# Altium schematic sheet RelayBoard.SchDoc
size A4
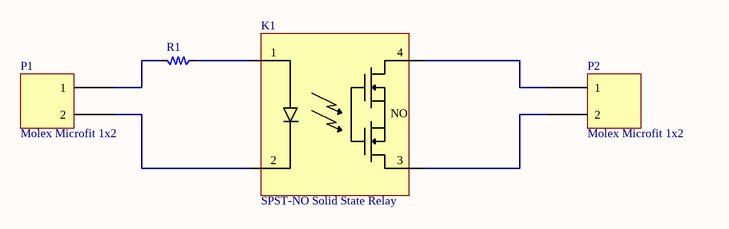
[diagram p0: RelayBoard.SchDoc]

## Parts
K1  SPST-NO Solid State Relay  [SPST-NO Solid State Relay - IXYS]
P1  Molex Microfit 1x2  [PCB_MLX_MICROFIT_1X2]
P2  Molex Microfit 1x2  [PCB_MLX_MICROFIT_1X2]
R1  SCH_GENERIC_RESISTOR_0603  [PCB_GENERIC_SMD_0603]  (value not drawn)

## Nets
NetK1_1: K1.1(Control_+) R1.1
NetK1_2: K1.2(Control_-) P1.2
NetK1_3: K1.3(Load) P2.2
NetK1_4: K1.4(Load) P2.1
NetP1_1: P1.1 R1.2

## Notes on the sheet
- (in symbol SPST-NO Solid State Relay) NO

## Library data of the parts
P1 P2 = SCH_MLX_1X2
R1 = SCH_GENERIC_RESISTOR_0603: Generic SMD resistor 0603